# EAGLE schematic k1fm-pico-balloon-v1.1 (EAGLE 9.4.1)
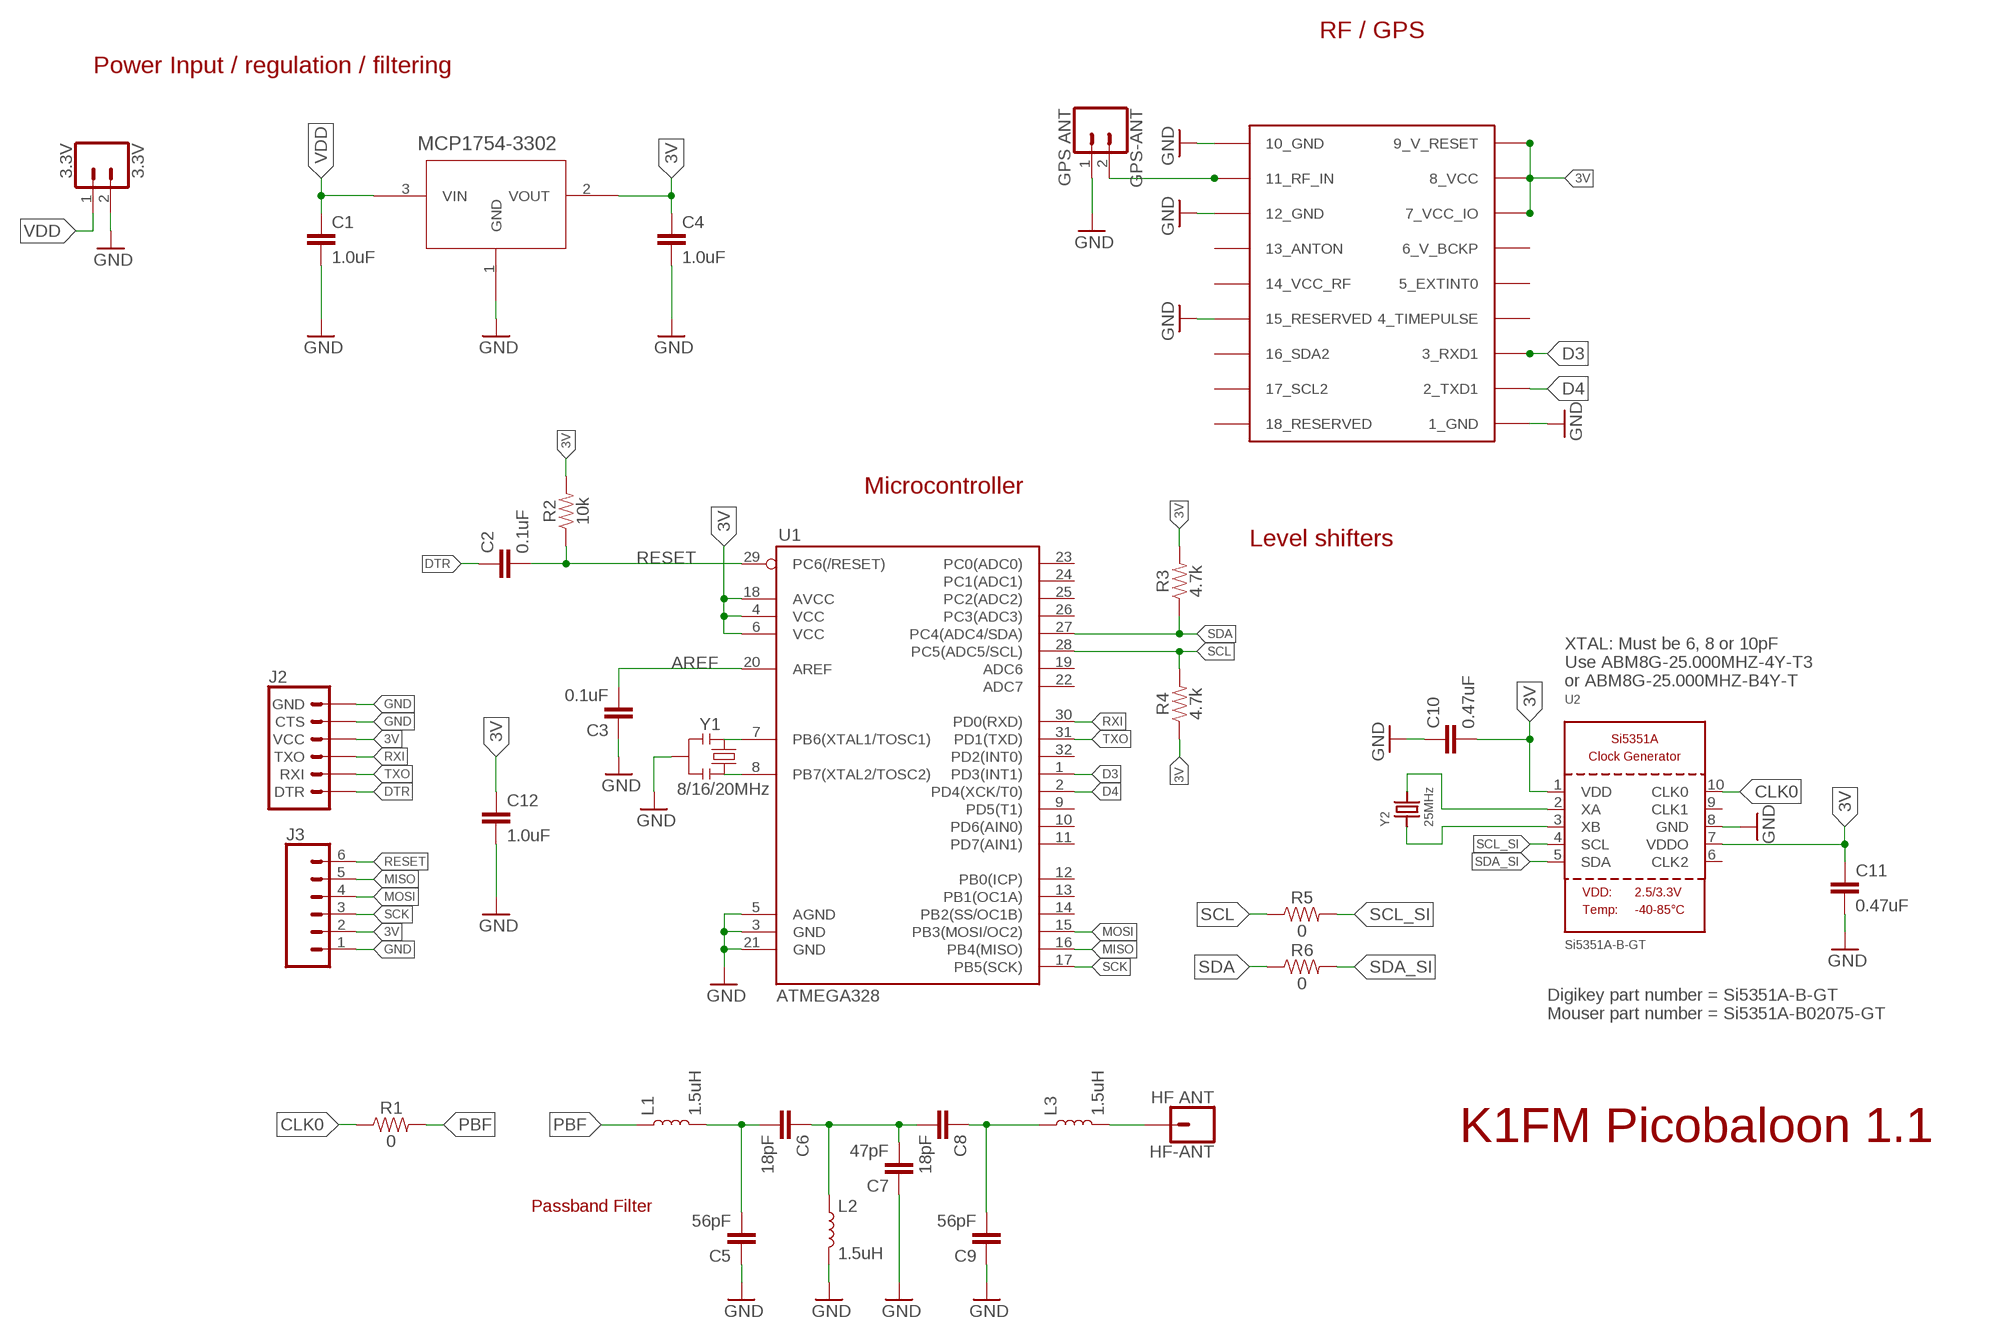
[diagram p0: schematic, sheet 1]

## Parts
3.3V  3.3V  CONN_02  [1X02]
C1  1.0uF  1.0UF-0603-16V-10%  [0603]
C2  0.1uF  0.1UF-0603-25V-5%  [0603]
C3  0.1uF  0.1UF-0603-25V-5%  [0603]
C4  1.0uF  1.0UF-0603-16V-10%  [0603]
C5  56pF  0.1UF-0603-25V-5%  [0603]
C6  18pF  0.1UF-0603-25V-5%  [0603]
C7  47pF  0.1UF-0603-25V-5%  [0603]
C8  18pF  0.1UF-0603-25V-5%  [0603]
C9  56pF  0.1UF-0603-25V-5%  [0603]
C10  0.47uF  0.1UF-0603-25V-5%  [0603]
C11  0.47uF  0.1UF-0603-25V-5%  [0603]
C12  1.0uF  1.0UF-0603-16V-10%  [0603]
GPS1  UBLOX_MAX  [UBLOX_MAX]
GPS-ANT  GPS ANT  CONN_02  [1X02]
HF-ANT  HF ANT  CONN_01  [1X01]
J2  6_PIN_SERIAL_TARGET  [1X06]
J3  CONN_06SILK_FEMALE_PTH  [1X06]
L1  1.5uH  INDUCTOR-0603-33NH  [0603]
L2  1.5uH  INDUCTOR-0603-33NH  [0603]
L3  1.5uH  INDUCTOR-0603-33NH  [0603]
R1  0  0OHM-0603-1/10W-5%  [0603]
R2  10k  10KOHM-0603-1/10W-1%  [0603]
R3  4.7k  4.7KOHM-0603-1/10W-1%  [0603]
R4  4.7k  4.7KOHM-0603-1/10W-1%  [0603]
R5  0  0OHM-0603-1/10W-5%  [0603]
R6  0  0OHM-0603-1/10W-5%  [0603]
U1  ATMEGA328  ATMEGA168  [TQFP32-08]
U2  Si5351A-B-GT  SI5351A  [MSOP10]
U3  MCP1754X-XXXXX/C  [SOT-23A_MC]
Y1  8/16/20MHz  RESONATOR1:1  [RESONATOR-SMD-1:1]
Y2  25MHz  CRYSTAL3.2X2.5  [CRYSTAL_3.2X2.5]

## Nets
3V: C4.1 C10.2 C11.1 C12.1 GPS1.7_VCC_IO GPS1.8_VCC GPS1.9_V_RESET J2.4(VCC) J3.2 R2.2 R3.2 R4.1 U1.4(VCC) U1.6(VCC) U1.18(AVCC) U2.1(VDD) U2.7(VDDO) U3.2(VOUT)
ANT: HF-ANT.1 L3.2
AREF: C3.2 U1.20(AREF)
CLK0: R1.1 U2.10(CLK0)
D3: GPS1.3_RXD1 U1.1(PD3(INT1))
D4: GPS1.2_TXD1 U1.2(PD4(XCK/T0))
DTR: C2.1 J2.1(DTR)
GND: 3.3V.2 C1.2 C3.1 C4.2 C5.1 C7.1 C9.1 C10.1 C11.2 C12.2 GPS1.1_GND GPS1.10_GND GPS1.12_GND GPS1.15_RESERVED GPS-ANT.1 J2.5(CTS) J2.6(GND) J3.1 L2.2 U1.3(GND) U1.5(AGND) U1.21(GND) U2.8(GND) U3.1(GND) Y1.2
MISO: J3.5 U1.16(PB4(MISO))
MOSI: J3.4 U1.15(PB3(MOSI/OC2))
N$6: GPS1.11_RF_IN GPS-ANT.2
N$9: C6.1 C7.2 C8.2 L2.1
N$12: C5.2 C6.2 L1.2
N$13: C8.1 C9.2 L3.1
N$14: U2.3(XB) Y2.1
N$17: U2.2(XA) Y2.2
N$28: U1.8(PB7(XTAL2/TOSC2)) Y1.3
N$29: U1.7(PB6(XTAL1/TOSC1)) Y1.1
PBF: L1.1 R1.2
RESET: C2.2 J3.6 R2.1 U1.29(PC6(/RESET))
RXI: J2.3(TXO) U1.30(PD0(RXD))
SCK: J3.3 U1.17(PB5(SCK))
SCL: R4.2 R5.1 U1.28(PC5(ADC5/SCL))
SCL_SI: R5.2 U2.4(SCL)
SDA: R3.1 R6.1 U1.27(PC4(ADC4/SDA))
SDA_SI: R6.2 U2.5(SDA)
TXO: J2.2(RXI) U1.31(PD1(TXD))
VDD: 3.3V.1 C1.1 U3.3(VIN)
Unconnected: GPS1.4_TIMEPULSE GPS1.5_EXTINT0 GPS1.6_V_BCKP GPS1.13_ANTON GPS1.14_VCC_RF GPS1.16_SDA2 GPS1.17_SCL2 GPS1.18_RESERVED U1.9(PD5(T1)) U1.10(PD6(AIN0)) U1.11(PD7(AIN1)) U1.12(PB0(ICP)) U1.13(PB1(OC1A)) U1.14(PB2(SS/OC1B)) U1.19(ADC6) U1.22(ADC7) U1.23(PC0(ADC0)) U1.24(PC1(ADC1)) U1.25(PC2(ADC2)) U1.26(PC3(ADC3)) U1.32(PD2(INT0)) U2.6(CLK2) U2.9(CLK1)

## Notes on the sheet
- RF / GPS
- Power Input / regulation / filtering
- Microcontroller
- Level shifters
- XTAL: Must be 6, 8 or 10pF
  Use ABM8G-25.000MHZ-4Y-T3
  or ABM8G-25.000MHZ-B4Y-T
- Digikey part number = Si5351A-B-GT
  Mouser part number = Si5351A-B02075-GT
- K1FM Picobaloon 1.1
- Passband Filter

## Library data of the parts
3.3V GPS-ANT = SparkFun-Connectors:CONN_02: Multi connection point. Often used as Generic Header-pin footprint for 0.1 inch spaced/style header connections On any of the 0.1 inch spaced packages, you can populate with these: Break Away Headers - Straight <https://www.sparkfun.com/products/116> (PRT-00116) Break Away Male Headers - Right Angle <https://www.sparkfun.com/products/553> (PRT-00553) Female Headers <https://www.sparkfun.com/products/115> (PRT-00115) Break Away Headers - Machine Pin <https://www.sparkfun.com/products/117> (PRT-00117) Break Away Female Headers - Swiss Machine Pin <https://www.sparkfun.com/products/743> (PRT-00743) For SCREWTERMINALS and SPRING TERMINALS visit here: Screw Terimnals on SparkFun.com <https://www.sparkfun.com/search/results?term=Screw+Terminals> (5mm/3.5mm/2.54mm spacing) This device is also useful as a general connection point to wire up your design to another part of your project. Our various solder wires solder well into these plated through hole pads. Hook-Up Wire - Assortment (Stranded, 22 AWG) <https://www.sparkfun.com/products/11375> (PRT-11375) Hook-Up Wire - Assortment (Solid Core, 22 AWG) <https://www.sparkfun.com/products/11367> (PRT-11367) View the entire wire category on our website here <https://www.sparkfun.com/categories/141> Special notes: Molex polarized connector foot print use with: PRT-08233 with associated crimp pins and housings. 2.54_SCREWTERM for use with PRT-10571. 3.5mm Screw Terminal footprints for PRT-08084 5mm Screw Terminal footprints for use with PRT-08432
C1 C4 C12 = SparkFun-Capacitors:1.0UF: 1µF ceramic capacitors A capacitor is a passive two-terminal electrical component used to store electrical energy temporarily in an electric field.; PROD_ID: CAP-00868
C2 C3 = SparkFun-Capacitors:0.1UF: 0.1µF ceramic capacitors A capacitor is a passive two-terminal electrical component used to store electrical energy temporarily in an electric field.; PROD_ID: CAP-08604
C5-C11 = SparkFun-Capacitors:0.1UF: 0.1µF ceramic capacitors A capacitor is a passive two-terminal electrical component used to store electrical energy temporarily in an electric field.; PROD_ID: CAP-08604; VALUE: 0.1uF
GPS1 = Ava:UBLOX_MAX: UBLOX MAX
HF-ANT = SparkFun-Connectors:CONN_01: Single connection point. Often used as Generic Header-pin footprint for 0.1 inch spaced/style header connections On any of the 0.1 inch spaced packages, you can populate with these: Break Away Headers - Straight <https://www.sparkfun.com/products/116> (PRT-00116) Break Away Male Headers - Right Angle <https://www.sparkfun.com/products/553> (PRT-00553) Female Headers <https://www.sparkfun.com/products/115> (PRT-00115) Break Away Headers - Machine Pin <https://www.sparkfun.com/products/117> (PRT-00117) Break Away Female Headers - Swiss Machine Pin <https://www.sparkfun.com/products/743> (PRT-00743) This device is also useful as a general connection point to wire up your design to another part of your project. Our various solder wires solder well into these plated through hole pads. Hook-Up Wire - Assortment (Stranded, 22 AWG) <https://www.sparkfun.com/products/11375> (PRT-11375) Hook-Up Wire - Assortment (Solid Core, 22 AWG) <https://www.sparkfun.com/products/11367> (PRT-11367) View the entire wire category on our website here <https://www.sparkfun.com/categories/141> Special notes: SMTSO-256-ET is a "flush mount" nut for a 4-40 screw. We mostly use this on specialty testbeds; it is a nice way to connect hardware to your PCB at an adjustable hieght. Also note, the SNAP packages are for using a snappable style connector. We sell a baggie of snaps and they are also used on two LilyPad designs: Snap Assortment - 30 pack (male and female) <https://www.sparkfun.com/products/11347> (DEV-11347) LilyPad Arduino SimpleSnap <https://www.sparkfun.com/products/10941> (DEV-10941) LilyPad SimpleSnap Protoboard <https://www.sparkfun.com/products/10940> (DEV-10940)
J2 = SparkFun-Connectors:6_PIN_SERIAL_TARGET: 6-pin header connection for use with the "FTDI BASIC" pinout - TARGET SIDE. Also known as "Arduino Serial Program Header". It is used to mate with our FTDI Basic serial programmers using the Arduino IDE. Note, this device has "TARGET" in the name. It is intended to be used on a design that contains a target micro-controller that you wish to program. The "sister" device, named "CABLE" is inteneded to be used on a design that usually lives on the end of your USB cable and prvides the converter chip (FTDI232 or FTDI231x) to commnicate serial RX/TX. You can populate with some of these: Break Away Headers - Straight <https://www.sparkfun.com/products/116> (PRT-00116) For reference (or to suit your programming needs) check out these designs: SparkFun FTDI Basic Breakout - 5V <https://www.sparkfun.com/products/9716> (DEV-09716) SparkFun FTDI Basic Breakout - 3.3V <https://www.sparkfun.com/products/9873> (DEV-09873) SparkFun FTDI SmartBasic <https://www.sparkfun.com/products/12935> (DEV-12935) SparkFun Beefy 3 - FTDI Basic Breakout <https://www.sparkfun.com/products/13746> (DEV-13746)
J3 = SparkFun-Connectors:CONN_06: Multi connection point. Often used as Generic Header-pin footprint for 0.1 inch spaced/style header connections On any of the 0.1 inch spaced packages, you can populate with these: Break Away Headers - Straight <https://www.sparkfun.com/products/116> (PRT-00116) Break Away Male Headers - Right Angle <https://www.sparkfun.com/products/553> (PRT-00553) Female Headers <https://www.sparkfun.com/products/115> (PRT-00115) Break Away Headers - Machine Pin <https://www.sparkfun.com/products/117> (PRT-00117) Break Away Female Headers - Swiss Machine Pin <https://www.sparkfun.com/products/743> (PRT-00743) Arduino Stackable Header - 6 Pin <https://www.sparkfun.com/products/9280> (PRT-09280) For SCREWTERMINALS and SPRING TERMINALS visit here: Screw Terimnals on SparkFun.com <https://www.sparkfun.com/search/results?term=Screw+Terminals> (5mm/3.5mm/2.54mm spacing) This device is also useful as a general connection point to wire up your design to another part of your project. Our various solder wires solder well into these plated through hole pads. Hook-Up Wire - Assortment (Stranded, 22 AWG) <https://www.sparkfun.com/products/11375> (PRT-11375) Hook-Up Wire - Assortment (Solid Core, 22 AWG) <https://www.sparkfun.com/products/11367> (PRT-11367) View the entire wire category on our website here <https://www.sparkfun.com/categories/141>; PROD_ID: CONN-08437
L1-L3 = SparkFun-Coils:INDUCTOR: Inductors Resist changes in electrical current. Basically a coil of wire. SparkFun Products: SparkFun Load Cell Amplifier - HX711 <https://www.sparkfun.com/products/13879> IOIO-OTG - V2.2 <https://www.sparkfun.com/products/13613>; PROD_ID: NDUC-07874; VALUE: 33nH/±5%/500mA
R1 R5 R6 = SparkFun-Resistors:0OHM: 0Ω resistor A resistor is a passive two-terminal electrical component that implements electrical resistance as a circuit element. Resistors act to reduce current flow, and, at the same time, act to lower voltage levels within circuits. - Wikipedia; PROD_ID: RES-08609
R2 = SparkFun-Resistors:10KOHM: 10kΩ resistor A resistor is a passive two-terminal electrical component that implements electrical resistance as a circuit element. Resistors act to reduce current flow, and, at the same time, act to lower voltage levels within circuits. - Wikipedia; PROD_ID: RES-00824
R3 R4 = SparkFun-Resistors:4.7KOHM: 4.7kΩ resistor A resistor is a passive two-terminal electrical component that implements electrical resistance as a circuit element. Resistors act to reduce current flow, and, at the same time, act to lower voltage levels within circuits. - Wikipedia; PROD_ID: RES-07857
U1 = SparkFun:ATMEGA168
U2 = microbuilder:SI5351A: Si5351A 8kHz-160MHz I2C Clock Generator VDD: 2.5V or 3.3V Input Range: 25MHz or 27MHz XTAL User selectable internal input load capacitors: 6, 8 or 10 pF Output Impedance: 85 Ohm Output Load Capacitance: 5-15pF Operating Temperature: -40°C - 85°C Operating Current (3 outputs): 35mA Output buffer voltage (VDDO): 1.8, 2.5 or 3.3V Note: If VDDO is not used it should be connected to VDD. Unused clock out pins should be left floating.
U3 = MCP1754:MCP1754X-XXXXX/C
Y1 = Testing:RESONATOR: Resonator Small SMD resonator. This is the itty bitty 10/20MHz resonators with built in caps. CSTCE10M0G55 and CSTCE20M0V53. Footprint for SMD has been used in SFE production for years, and does work okay. 1:1 is an attempt to get larger fillets on the sides so it will be easier to inspect these solders in our AOI machine. The pads have been minimized to match the actual metal under the resonator. To see this relation, it includes an image import of the bottom side of the component. Imported to scale on layer 200.
Y2 = microbuilder:CRYSTAL: Crystals HC49UP - Surface Mount Crystal 4.0MHz 18pF +/-30ppm Surface Mount Crystal [Digikey: 535-9857-1-ND] 12.0 MHz Surface Mount Crystal [Digikey: 535-9869-6-ND] 25.0 MHz Surface Mount Crystal [Digikey: 535-9078-1-ND] 2.5 x 2.0mm - MEMs SMT Crystal 16.0 MHz 10pF 20ppm 2.5 x 2.0mm Crystal [Digikey -40-85°C: 535-10923-1-ND] 3.2 x 2.5mm - MEMs SMT Crystal 12.0 MHz 8pF 15ppm 3.2 x 2.5mm Crystal [Digikey: -10-70°C: 644-1047-1-ND -40-125°C: 644-1128-1-ND] 40~85°C cheaper: 644-1173-6-ND 16.0 MHz 8pF 15ppm 3.2 x 2.5mm Crystal [Digikey: -10-70°C: 644-1049-1-ND -40-125°C: 644-1129-2-ND]-40~85°C cheaper: 644-1175-6-ND 16.0 MHz 10pF 10ppm 3.2 x 2.5mm Crystal [Digikey: 644-1100-1-ND] 27.12 MHz 18pF 30ppm 3.2 x 2.5mm Crystal [Digikey: 887-1424-1-ND] 27.12MHz 10pF 10ppm 3.2 x 2.5mm Crystal [Digikey: 887-1329-1-ND] 4.9 x 1.8mm - MEMs SMT Crystal 32.768 KHz 12.5pF 20ppm 4.9 x 1.8mm Crystal [Digikey: SE2415CT-ND] 8.0 x 3.8mm - Surface Mount Crystal 32.768kHz 12.5pF 20ppm -40°C-85°C [Digikey: 535-9166-2-ND] Cylinder 32.768KHz Cylinder Crystal (2x6mm body) [Ex. Digikey: 300-8341-2-ND]

## Net classes
1 vcc: width 0.254 mm